# Altium schematic sheet megabit-I2C-TOP.SchDoc: Megabit Proto Top-Level Schematic
size A4; DrawnBy: Megabit Team; DocumentNumber: 1; Revision: 1; SheetNumber: 1; SheetTotal: 2
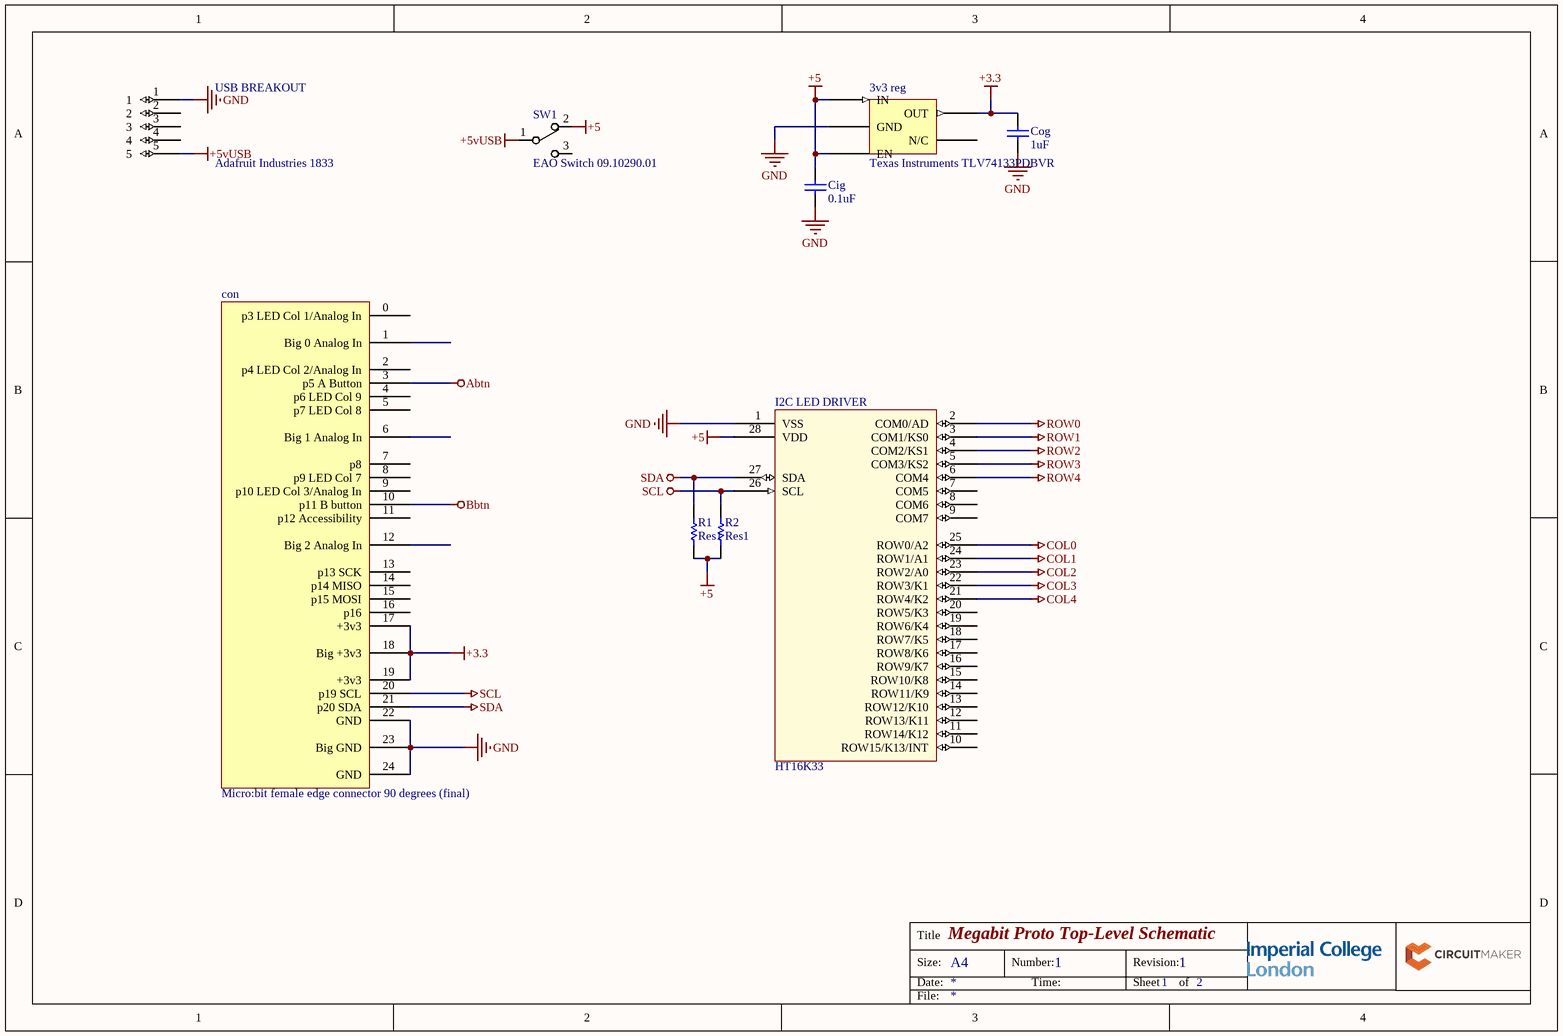
[diagram p0: megabit-I2C-TOP.SchDoc]

## Parts
3v3_reg  Texas Instruments TLV74133PDBVR  [PCB-e30blpvsozc7nnftiis2-1]
Cig  0.1uF  [Vishay K104K15X7RF5TL2]
Cog  1uF  [Vishay K104K15X7RF5TL2]
con  Micro:bit female edge connector 90 degrees (final)  [PCBComponent_1 - duplicate]
I2C_LED_DRIVER  HT16K33  [PCB-otwcc1b496jwxezlenqc-1]
R1  Res1  [PCB-3613466-1]
R2  Res1  [PCB-3613466-1]
SW1  EAO Switch 09.10290.01  [PCB-1akl86m7w5ikau1ha4dm-1]
USB_BREAKOUT  Adafruit Industries 1833  [PCB-lrx1ysvqy1j2hi3n37c6-1]

## Nets
+3.3: 3v3_reg.4(OUT) Cog.2 con.17(+3v3) con.18(Big_+3v3) con.19(+3v3)
+5: 3v3_reg.1(IN) 3v3_reg.3(EN) Cig.2 I2C_LED_DRIVER.28(VDD) R1.1 R2.1 SW1.2
+5vUSB: SW1.1 USB_BREAKOUT.5
Abtn: con.3(p5_A_Button)
Bbtn: con.10(p11_B_button)
COL0: I2C_LED_DRIVER.25(ROW0/A2)
COL1: I2C_LED_DRIVER.24(ROW1/A1)
COL2: I2C_LED_DRIVER.23(ROW2/A0)
COL3: I2C_LED_DRIVER.22(ROW3/K1)
COL4: I2C_LED_DRIVER.21(ROW4/K2)
GND: 3v3_reg.2(GND) Cig.1 Cog.1 con.22(GND) con.23(Big_GND) con.24(GND) I2C_LED_DRIVER.1(VSS) USB_BREAKOUT.1
ROW0: I2C_LED_DRIVER.2(COM0/AD)
ROW1: I2C_LED_DRIVER.3(COM1/KS0)
ROW2: I2C_LED_DRIVER.4(COM2/KS1)
ROW3: I2C_LED_DRIVER.5(COM3/KS2)
ROW4: I2C_LED_DRIVER.6(COM4)
SCL: con.20(p19_SCL) I2C_LED_DRIVER.26(SCL) R2.2
SDA: con.21(p20_SDA) I2C_LED_DRIVER.27(SDA) R1.2

Not connected (* = marked no-connect by the designer): 3v3_reg 5(N/C); con 0(p3_LED_Col_1/Analog_In) 1(Big_0_Analog_In) 2(p4_LED_Col_2/Analog_In) 4(p6_LED_Col_9) 5(p7_LED_Col_8) 6(Big_1_Analog_In) 7(p8) 8(p9_LED_Col_7) 9(p10_LED_Col_3/Analog_In) 11(p12_Accessibility) 12(Big_2_Analog_In) 13(p13_SCK) 14(p14_MISO) 15(p15_MOSI) 16(p16); I2C_LED_DRIVER 7(COM5) 8(COM6) 9(COM7) 10(ROW15/K13/INT) 11(ROW14/K12) 12(ROW13/K11) 13(ROW12/K10) 14(ROW11/K9) 15(ROW10/K8) 16(ROW9/K7) 17(ROW8/K6) 18(ROW7/K5) 19(ROW6/K4) 20(ROW5/K3); SW1 3; USB_BREAKOUT 2 3 4

## Notes on the sheet
- Title
- Size:
- Date:
- A4
- Number:
- Time:
- Revision:
- Sheet
- of
- File:

## Library data of the parts
3v3_reg = CMP-ad66616159c672a1-4: 150mA Low-Dropout (LDO) Regulator With Foldback Current Limit for Portable Devices 5-SOT-23 -40 to 125; Dropout Voltage: 230 mV; Quiescent Current: 50.0 µA; Number of Regulated Outputs: 1; Output Capacitor Type: Ceramic; RoHS: Compliant; Octopart URL: https://octopart.com/tlv74133pdbvr-texas+instruments-84791750; Operating Temperature: -40.0 °C to 125 °C; OctopartID: ad66616159c672a1; Manufacturer Part Number: TLV74133PDBVR; Number of Pins: 5; Lifecycle Status: Pre-Release; Case/Package: SOT-23
Cig Cog = CMP-124240-16: K Series 100nF 50 V ±10 % Tolerance X7R Radial Multilayer Ceramic Capacitor; Manufacturer Part Number: K104K15X7RF5TL2; Lead Length: 30mm; Lead-Free Status: Lead Free; Voltage Rating (DC): 50 V; Capacitance Tolerance: ±10%; Size-Height: 5.6mm; Size-Width: 4.0mm; Mounting Style: Through Hole; OctopartID: e7292e20c87538ee; Number of Pins: 2; Packaging: Cut Tape (CT), Tape & Reel (TR); Capacitance: 100 nF; Octopart URL: http://octopart.com/k104k15x7rf5tl2-vishay+bccomponents-199226; Dielectric Material: Ceramic; Dielectric Characteristic: X7R; Size-Lead Diameter: 0.5mm; RoHS: Compliant; Size-Thickness: 2.6mm
con = CMP-mom7rix79jkpy4z4w6go-13: http://www.dgyuliang.net/html/279.html; CustomComponentID: mom7rix79jkpy4z4w6go
I2C_LED_DRIVER = CMP-58709250411787b7-2: 3M(TM) Stikit(TM) Gold Disc Roll, 01427, 5 in, P100A, 125 discs per roll, 10 rolls per case; REACH SVHC Compliance: No SVHC
R1 R2 = CMP-b15c796618a36e9b-3: Resistor 0.25W; OctopartID: b15c796618a36e9b
SW1 = CMP-a30d6b12014b7cca-5: SLIDE SWITCH, SPDT, HORIZ; Series: 1K2; Switch Function Type: SPDT, R/A; Contact Configuration: SPDT; Voltage, Contac...; Insulation Resistance: 10.0 GΩ; Contact Resistance: 22.0 mΩ; Octopart URL: http://octopart.com/09.10290.01-eao+switch-18188064; Manufacturer Part Number: 09.10290.01; Orientation: Right Angle; RoHS: Compliant; Mounting Style: PCB; Contacts Type: SPDT; OctopartID: a30d6b12014b7cca
USB_BREAKOUT = CMP-bfb17591a6f36076-1: Standoff; Threaded Female 1/4 Hex; 6-32 Thread; Length .875; Brass/Zinc; Manufacturer Part Number: 1833; Lead-Free Status: Lead Free; OctopartID: bfb17591a6f36076; Size-Width: 6.35 mm; Size-Diameter: 6.35 mm; Octopart URL: http://octopart.com/1833-adafruit+industries-53099556; Material: Brass; Size-Length: 22.2 mm